# EasyEDA schematic automatic feline deterrent_2021-05-23.json
TITLE: Raspbery Pi Hat + particle Argon Slot; REV: 1.0; Date: 2018-04-22; Sheet: 1/1; Drawn By: hgzaunick
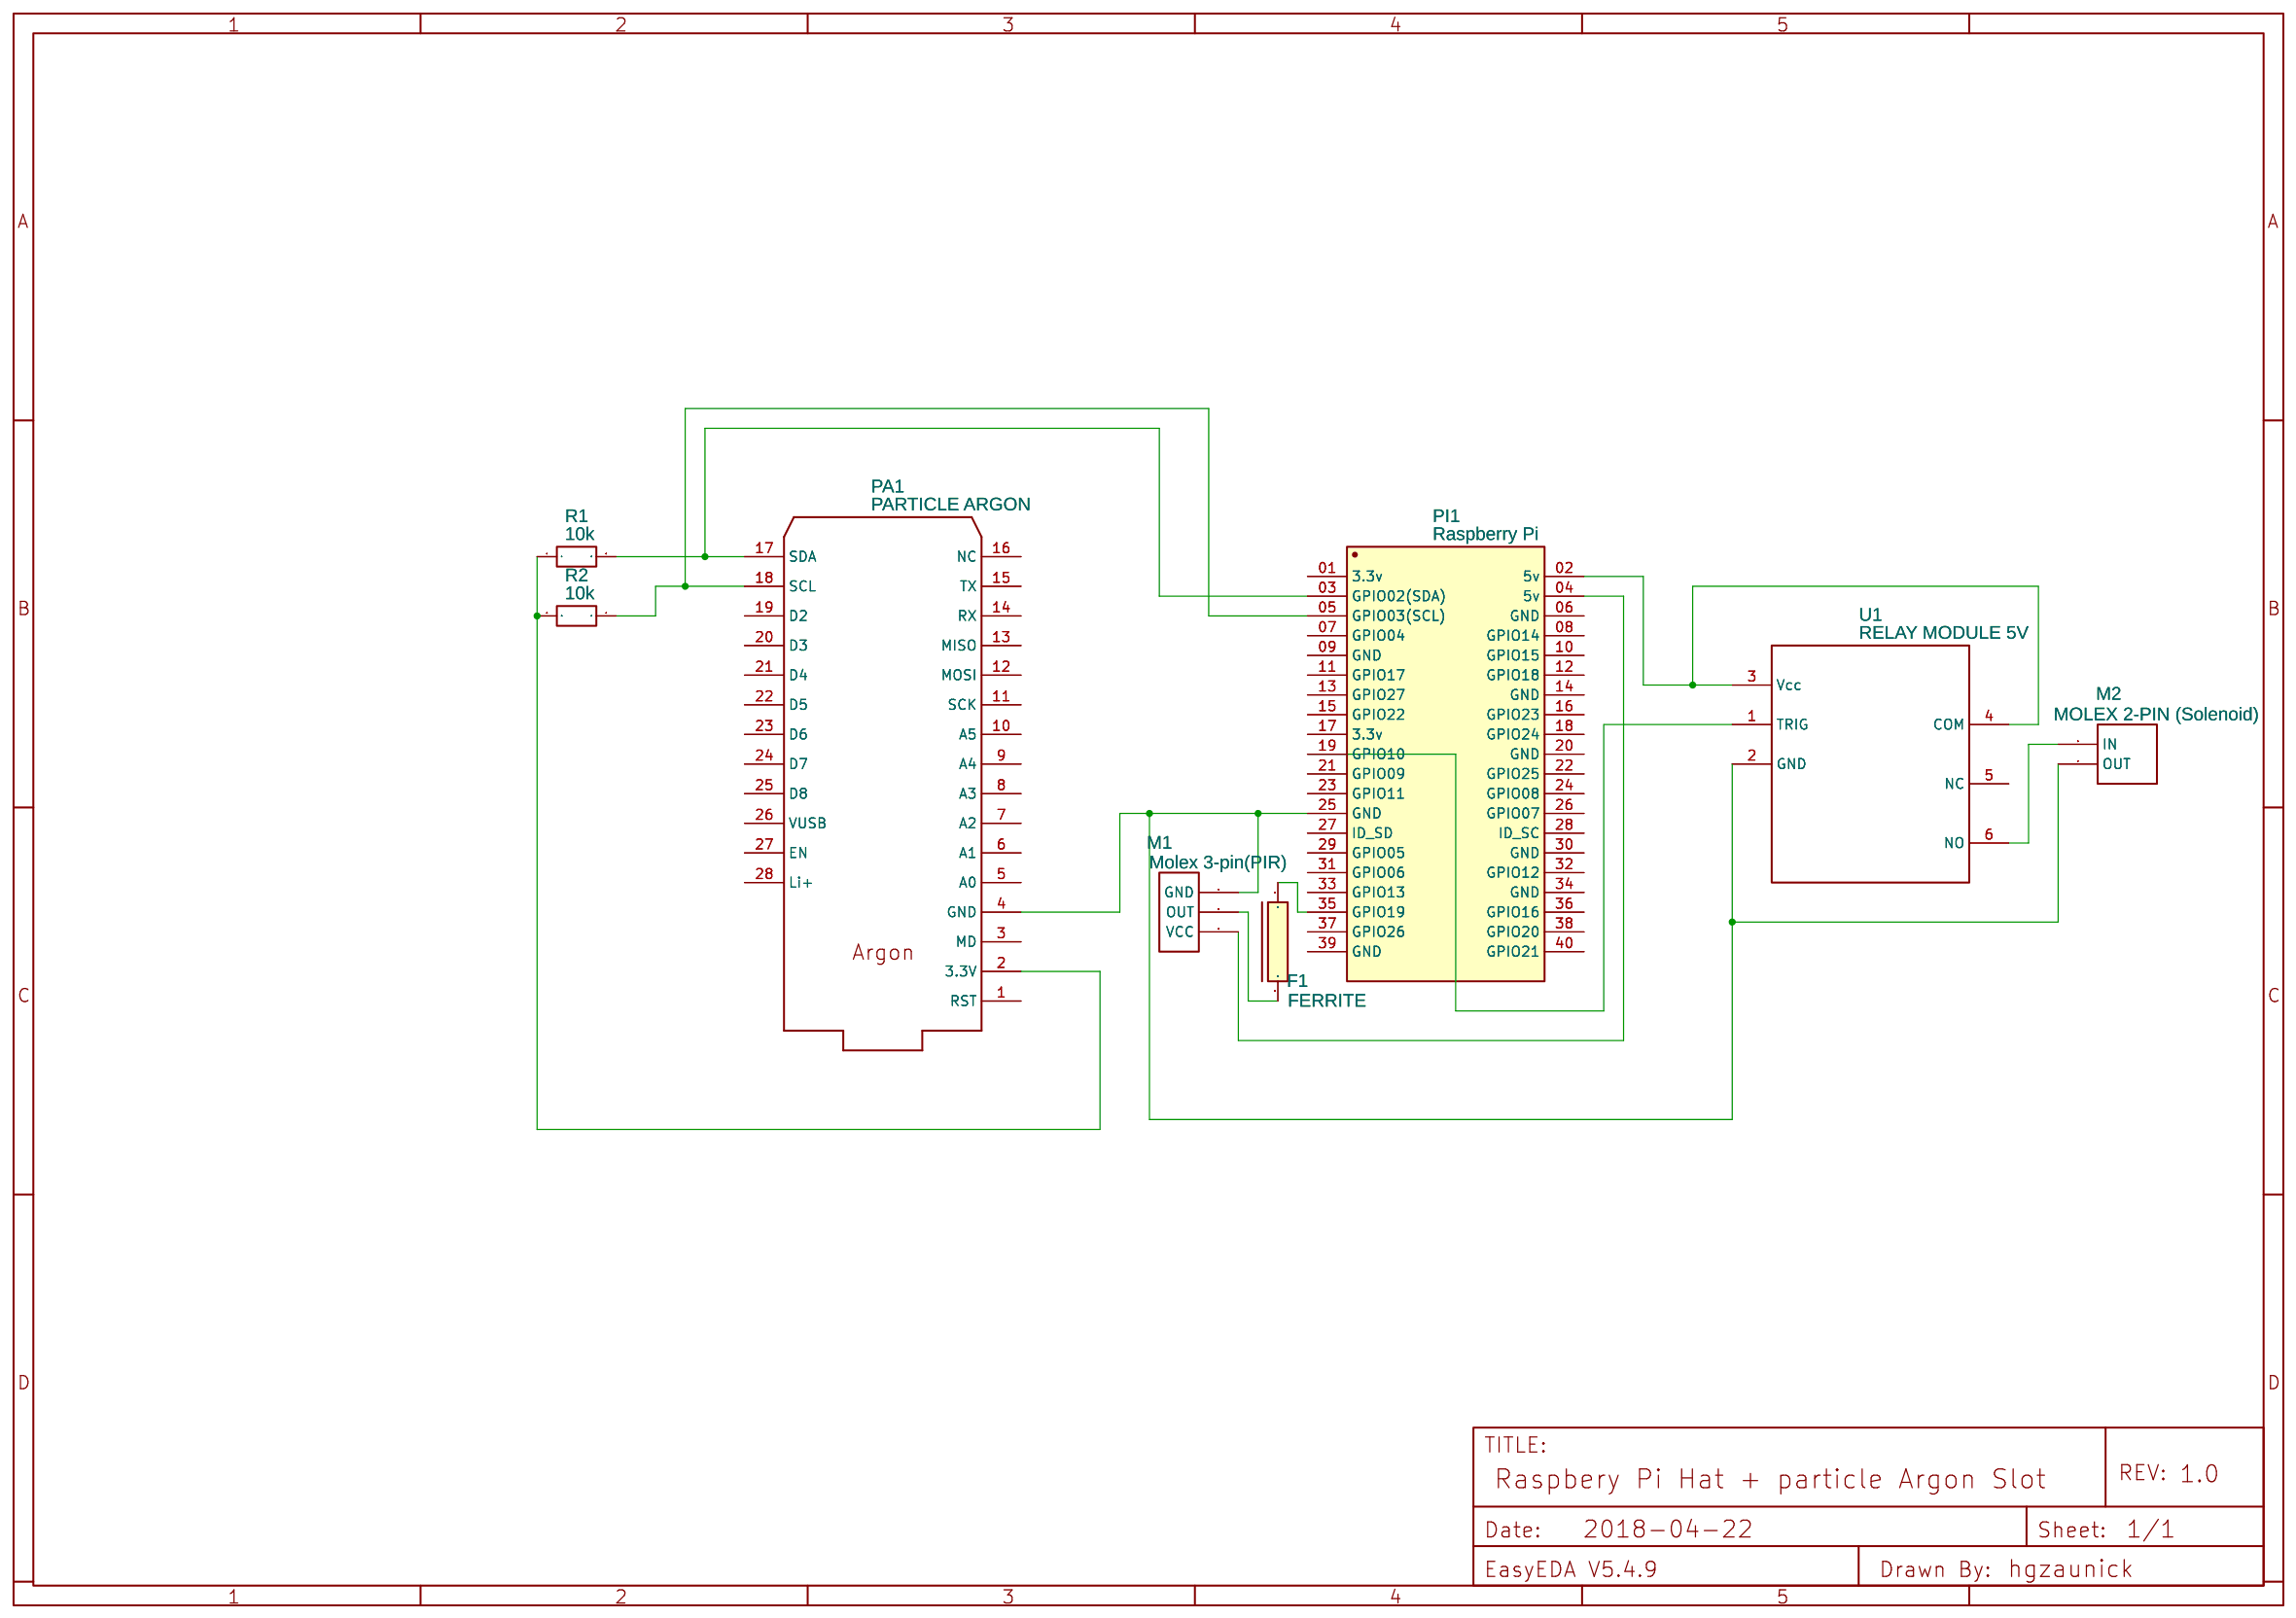
[diagram p0: schematic sheet]

## Parts
F1  FERRITE  [L10]
M1  Molex 3-pin(PIR)  [MOLEX PICOBLADE 3P SMD RA]
M2  MOLEX 2-PIN (Solenoid)  [MOLEX PICOBLADE 2P SMD]
PA1  PARTICLE ARGON  [PARTICLE ARGON]
PI1  Raspberry Pi  [GPIO HEADER (2X20)]
R1  10k  [R0603]
R2  10k  [R0603]
U1  RELAY MODULE 5V  [BASIC SPDT RELAY CARRIER WITH 12VDC RELAY]

## Library data of the parts
F1 = FERRITE: Contributor: DangerousPrototype
M1 = Molex white 3-pin: Contributor: Dror
M2 = MOLEX WHITE 2-PIN: Manufacturer Part: Molex white 2-pin; Contributor: Dror
PA1 = PARTICLE ARGON: Manufacturer: Particle; Manufacturer Part: Particle Argon; Supplier Part: Particle Argon; Supplier: Particle; Contributor: stevecoster
PI1 = Raspberry Pi: sourceId: gQK2WevN5; Supplier Part: 485-2222; Contributor: Rifaie
R1 R2 = R_0603_EU: Contributor: LCEDA_Lib
U1 = ARDUINO RELAY MODULE 5V: Contributor: marco tozzato; sourceId: YsmgyP7pj

## Nets
Net-(F1-1): F1.1 PI1.35(GPIO19)
Net-(F1-2): F1.2 M1.2(OUT)
Net-(M1-1): M1.1(GND) M2.1(OUT) PA1.4(GND) PI1.25(GND) U1.2(GND)
Net-(M1-3): M1.3(VCC) PI1.04(5v)
Net-(M2-2): M2.2(IN) U1.6(NO)
Net-(PA1-2): PA1.2(3.3V) R1.1 R2.2
Net-(PA1-17): PA1.17(SDA) PI1.03(GPIO02(SDA)) R1.2
Net-(PA1-18): PA1.18(SCL) PI1.05(GPIO03(SCL)) R2.1
Net-(PI1-02): PI1.02(5v) U1.3(Vcc) U1.4(COM)
Net-(PI1-19): PI1.19(GPIO10) U1.1(TRIG)

Not connected (* = marked no-connect by the designer): PA1 1(RST) 3(MD) 5(A0) 6(A1) 7(A2) 8(A3) 9(A4) 10(A5) 11(SCK) 12(MOSI) 13(MISO) 14(RX) 15(TX) 16(NC) 19(D2) 20(D3) 21(D4) 22(D5) 23(D6) 24(D7) 25(D8) 26(VUSB) 27(EN) 28(Li+); PI1 01(3.3v) 06(GND) 07(GPIO04) 08(GPIO14) 09(GND) 10(GPIO15) 11(GPIO17) 12(GPIO18) 13(GPIO27) 14(GND) 15(GPIO22) 16(GPIO23) 17(3.3v) 18(GPIO24) 20(GND) 21(GPIO09) 22(GPIO25) 23(GPIO11) 24(GPIO08) 26(GPIO07) 27(ID_SD) 28(ID_SC) 29(GPIO05) 30(GND) 31(GPIO06) 32(GPIO12) 33(GPIO13) 34(GND) 36(GPIO16) 37(GPIO26) 38(GPIO20) 39(GND) 40(GPIO21); U1 5(NC)
